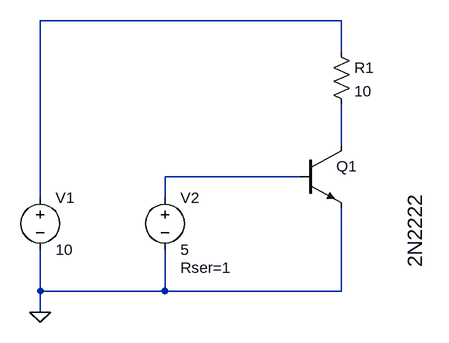
[diagram p0: schematic Test3.asc]
Test3.asc, the LTspice schematic file:
Version 4
SHEET 1 880 680
WIRE 288 -64 -176 -64
WIRE 288 -16 288 -64
WIRE 288 128 288 64
WIRE 224 176 16 176
WIRE -176 208 -176 -64
WIRE 16 208 16 176
WIRE -176 352 -176 288
WIRE 16 352 16 288
WIRE 16 352 -176 352
WIRE 288 352 288 224
WIRE 288 352 16 352
WIRE -176 384 -176 352
FLAG -176 384 0
SYMBOL voltage -176 192 R0
WINDOW 123 0 0 Left 0
WINDOW 39 0 0 Left 0
SYMATTR InstName V1
SYMATTR Value 10
SYMBOL voltage 16 192 R0
WINDOW 123 0 0 Left 0
WINDOW 39 24 124 Left 2
SYMATTR InstName V2
SYMATTR Value 5
SYMATTR SpiceLine Rser=1
SYMBOL npn 224 128 R0
WINDOW 3 177 188 VLeft 3
SYMATTR InstName Q1
SYMATTR Value 2N2222
SYMBOL res 272 -32 R0
SYMATTR InstName R1
SYMATTR Value 10
SYMATTR SpiceLine tol=1 pwr=1.25

The netlist it stands for:
* Test3.asc
V1 N001 0 10
V2 N003 0 5 Rser=1
Q1 N002 N003 0 0 2N2222
R1 N001 N002 10 tol=1 pwr=1.25
.model NPN NPN
.model PNP PNP
.lib standard.bjt
.backanno
.end